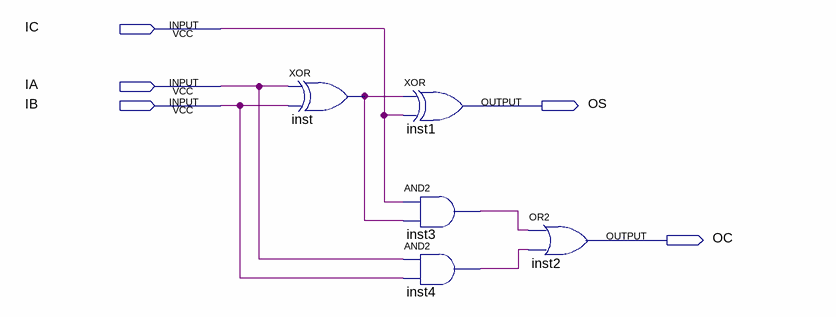
[diagram p0: schematic sheet]
// Quartus schematic full_adder.bdf as structural Verilog: 5 symbols, 5 pins
module full_adder (
  input  IC,
  input  IA,
  input  IB,
  output OS,
  output OC
);

  wire inst3_out, inst4_out, inst_out;

  xor inst (inst_out, IA, IB);
  xor inst1 (OS, inst_out, IC);
  and inst3 (inst3_out, IC, inst_out);
  and inst4 (inst4_out, IA, IB);
  or inst2 (OC, inst3_out, inst4_out);
endmodule
